# EAGLE schematic Hiveopolis (EAGLE 9.6.2)
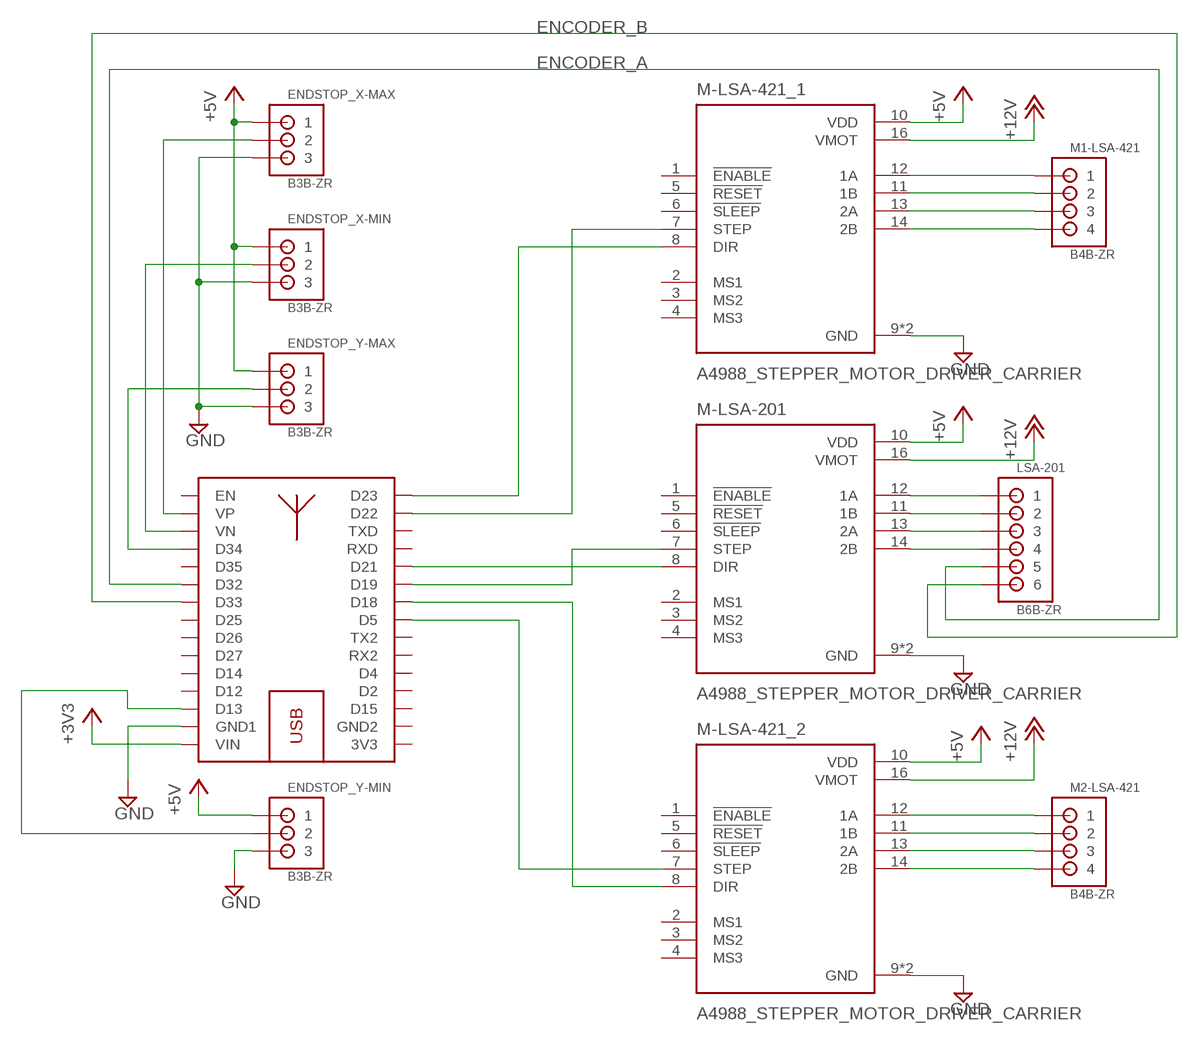
[diagram p0: schematic, sheet 1]

## Parts
ENDSTOP_X-MAX  B3B-ZR  [B3B-ZR]
ENDSTOP_X-MIN  B3B-ZR  [B3B-ZR]
ENDSTOP_Y-MAX  B3B-ZR  [B3B-ZR]
ENDSTOP_Y-MIN  B3B-ZR  [B3B-ZR]
LSA-201  B6B-ZR  [B6B-ZR]
M1  ESP32_DEVKIT_V1  [ARDUINO_NANO_V3]
M1-LSA-421  B4B-ZR  [B4B-ZR]
M2-LSA-421  B4B-ZR  [B4B-ZR]
M-LSA-201  A4988_STEPPER_MOTOR_DRIVER_CARRIER  [MODULE_A4988_STEPPER_MOTOR_DRIVER_CARRIER]
M-LSA-421_1  A4988_STEPPER_MOTOR_DRIVER_CARRIER  [MODULE_A4988_STEPPER_MOTOR_DRIVER_CARRIER]
M-LSA-421_2  A4988_STEPPER_MOTOR_DRIVER_CARRIER  [MODULE_A4988_STEPPER_MOTOR_DRIVER_CARRIER]

## Nets
+3V3: M1.P$28(VIN)
+5V: ENDSTOP_X-MAX.1 ENDSTOP_X-MIN.1 ENDSTOP_Y-MAX.1 ENDSTOP_Y-MIN.1 M-LSA-201.10(VDD) M-LSA-421_1.10(VDD) M-LSA-421_2.10(VDD)
+12V: M-LSA-201.16(VMOT) M-LSA-421_1.16(VMOT) M-LSA-421_2.16(VMOT)
ENCODER_A: LSA-201.5 M1.P$17(D32)
ENCODER_B: LSA-201.6 M1.P$18(D33)
GND: ENDSTOP_X-MAX.3 ENDSTOP_X-MIN.3 ENDSTOP_Y-MAX.3 ENDSTOP_Y-MIN.3 M1.P$22(GND1) M-LSA-201.9(GND) M-LSA-201.15(GND) M-LSA-421_1.9(GND) M-LSA-421_1.15(GND) M-LSA-421_2.9(GND) M-LSA-421_2.15(GND)
N$1: M1.P$12(D22) M-LSA-421_1.7(STEP)
N$2: M1.P$13(D23) M-LSA-421_1.8(DIR)
N$5: M1.P$9(D18) M-LSA-421_2.8(DIR)
N$6: M1.P$4(D5) M-LSA-421_2.7(STEP)
N$7: M1.P$11(D21) M-LSA-201.8(DIR)
N$8: M1.P$10(D19) M-LSA-201.7(STEP)
N$9: M1-LSA-421.1 M-LSA-421_1.12(1A)
N$10: M1-LSA-421.2 M-LSA-421_1.11(1B)
N$11: M1-LSA-421.3 M-LSA-421_1.13(2A)
N$12: M1-LSA-421.4 M-LSA-421_1.14(2B)
N$17: M2-LSA-421.1 M-LSA-421_2.12(1A)
N$18: M2-LSA-421.2 M-LSA-421_2.11(1B)
N$19: M2-LSA-421.3 M-LSA-421_2.13(2A)
N$20: M2-LSA-421.4 M-LSA-421_2.14(2B)
N$21: LSA-201.1 M-LSA-201.12(1A)
N$22: LSA-201.2 M-LSA-201.11(1B)
N$23: LSA-201.3 M-LSA-201.13(2A)
N$24: LSA-201.4 M-LSA-201.14(2B)
N$27: ENDSTOP_Y-MAX.2 M1.P$19(D34)
N$28: ENDSTOP_X-MAX.2 M1.P$30(VP)
N$29: ENDSTOP_X-MIN.2 M1.P$29(VN)
N$30: ENDSTOP_Y-MIN.2 M1.P$6(D13)
Unconnected: M1.P$1(3V3) M1.P$2(D2) M1.P$3(D4) M1.P$5(D12) M1.P$7(D14) M1.P$8(D15) M1.P$14(D25) M1.P$15(D26) M1.P$16(D27) M1.P$20(D35) M1.P$21(EN) M1.P$23(GND2) M1.P$24(RX2) M1.P$25(RXD) M1.P$26(TX2) M1.P$27(TXD) M-LSA-201.1(!ENABLE) M-LSA-201.2(MS1) M-LSA-201.3(MS2) M-LSA-201.4(MS3) M-LSA-201.5(!RESET) M-LSA-201.6(!SLEEP) M-LSA-421_1.1(!ENABLE) M-LSA-421_1.2(MS1) M-LSA-421_1.3(MS2) M-LSA-421_1.4(MS3) M-LSA-421_1.5(!RESET) M-LSA-421_1.6(!SLEEP) M-LSA-421_2.1(!ENABLE) M-LSA-421_2.2(MS1) M-LSA-421_2.3(MS2) M-LSA-421_2.4(MS3) M-LSA-421_2.5(!RESET) M-LSA-421_2.6(!SLEEP)

## Library data of the parts
ENDSTOP_X-MAX ENDSTOP_X-MIN ENDSTOP_Y-MAX ENDSTOP_Y-MIN = jst:B3B-ZR: JST-ZH Connector 3 pol, 1.5mm pitch Package: B3B-ZR Source: http://www.jst-mfg.com/product/pdf/eng/eZH.pdf
LSA-201 = jst:B6B-ZR: JST-ZH Connector 6 pol, 1.5mm pitch Package: B6B-ZR Source: http://www.jst-mfg.com/product/pdf/eng/eZH.pdf
M1 = ESP32_DEVKIT_V1:ESP32_DEVKIT_V1: Check prices <https://pricing.snapeda.com/parts/ESP32%20DEVKIT%20V1/Do%20it/view-part?ref=eda>; AVAILABILITY: No availability data; DESCRIPTION: Dual core, Wi-Fi: 2.4 GHz up to 150 Mbits/s,BLE (Bluetooth Low Energy) and legacy Bluetooth, 32 bits, Up to 240 MHz; MF: Do it; MP: ESP32 DEVKIT V1; PACKAGE: Package; PRICE: None
M1-LSA-421 M2-LSA-421 = jst:B4B-ZR: JST-ZH Connector 4 pol, 1.5mm pitch Package: B4B-ZR Source: http://www.jst-mfg.com/product/pdf/eng/eZH.pdf
M-LSA-201 M-LSA-421_1 M-LSA-421_2 = A4988_STEPPER_MOTOR_DRIVER_CARRIER:A4988_STEPPER_MOTOR_DRIVER_CARRIER: Stepper motor controler; IC: A4988; 1A; Uin mot: 8÷35V Check prices <https://pricing.snapeda.com/parts/A4988%20STEPPER%20MOTOR%20DRIVER%20CARRIER/Pololu/view-part?ref=eda>; AVAILABILITY: No availability data; DESCRIPTION: Stepper Motor Driver; MF: Pololu; MP: A4988 STEPPER MOTOR DRIVER CARRIER; PACKAGE: None; PRICE: None